# EAGLE design badgezadas (EAGLE 9.6.2)
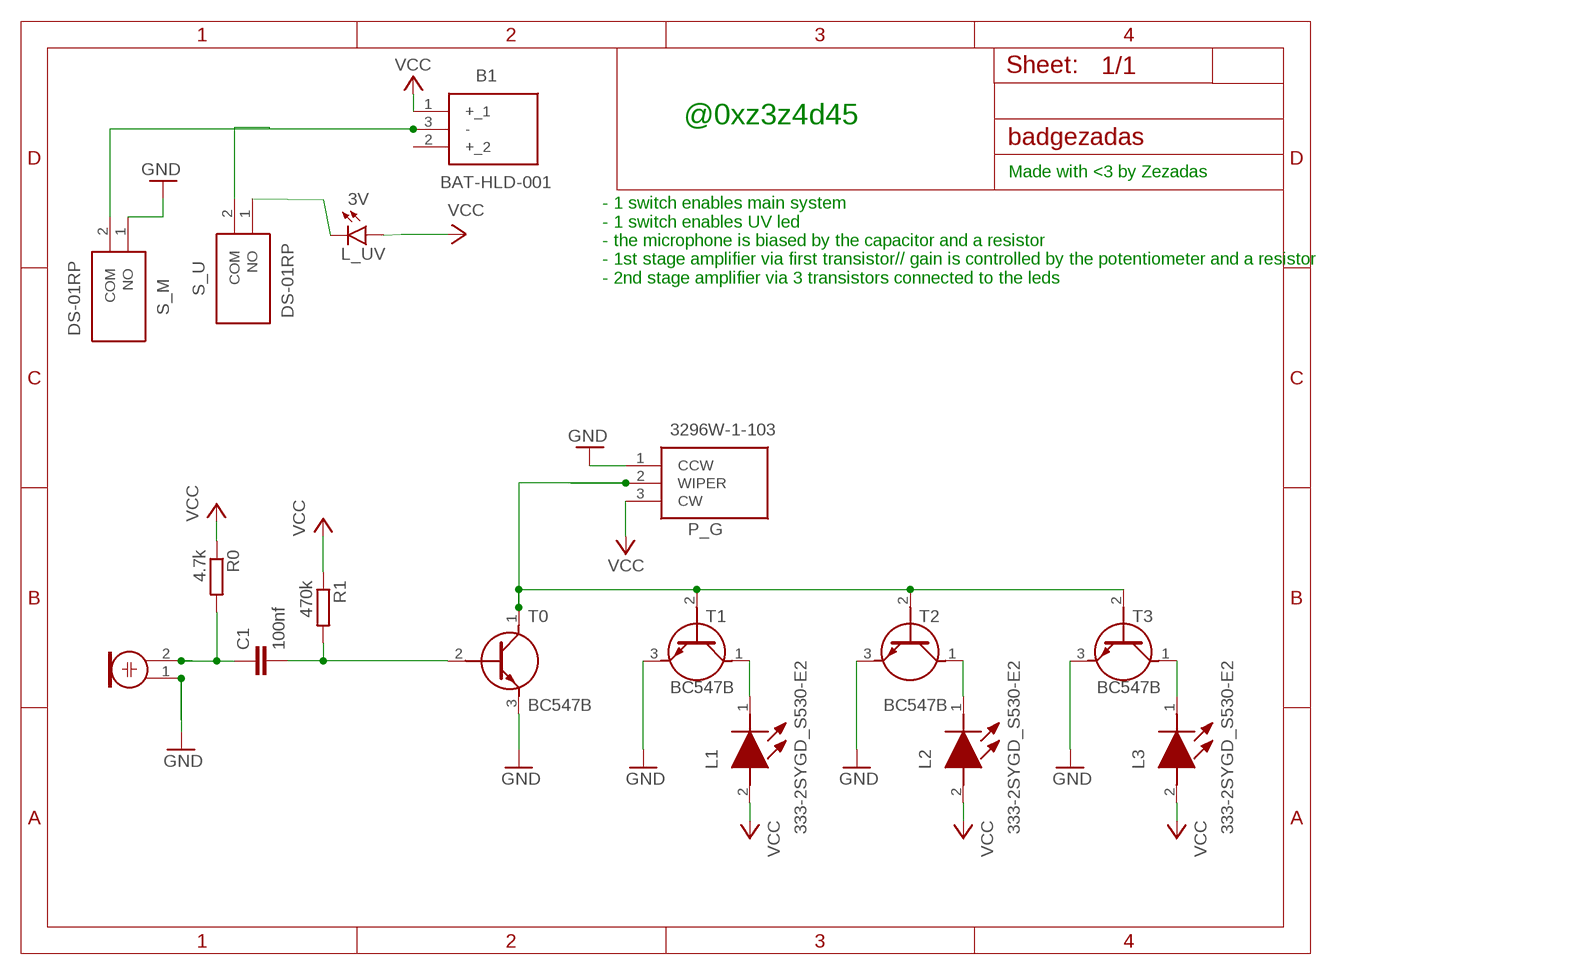
[diagram p0: schematic, sheet 1]

## Parts
B1  BAT-HLD-001  [BATHLD001]
C1  100nf  C-EU025-024X044  [C025-024X044]
L1  333-2SYGD_S530-E2  [3332SYGDS530E2]
L2  333-2SYGD_S530-E2  [3332SYGDS530E2]
L3  333-2SYGD_S530-E2  [3332SYGDS530E2]
L_UV  3V  LED3MM  [LED3MM]
M0  ELECTRET_MICROPHON-F6050AP  [F6050AP]
P_G  3296W-1-103  [3296W1103]
R0  4.7k  R-EU_0207/10  [0207/10]
R1  470k  R-EU_0207/10  [0207/10]
S_M  DS-01RP  [DS01RP]
S_U  DS-01RP  [DS01RP]
T0  BC547B  [TO-92-PLASTIC_2]
T1  BC547B  [TO-92-PLASTIC_2]
T2  BC547B  [TO-92-PLASTIC_2]
T3  BC547B  [TO-92-PLASTIC_2]

## Nets
GND: M0.1 P_G.1(CCW) S_M.1(NO) T0.3(E) T1.3(E) T2.3(E) T3.3(E)
N$1: C1.1 M0.2 R0.2
N$2: C1.2 R1.2 T0.2(B)
N$3: L_UV.K(C) S_U.1(NO)
N$4: P_G.2(WIPER) T0.1(C) T1.2(B) T2.2(B) T3.2(B)
N$5: L1.1(K) T1.1(C)
N$6: L3.1(K) T3.1(C)
N$7: B1.3(-) S_M.2(COM) S_U.2(COM)
N$10: L2.1(K) T2.1(C)
VCC: B1.1(+_1) L1.2(A) L2.2(A) L3.2(A) L_UV.A P_G.3(CW) R0.1 R1.1
Unconnected: B1.2(+_2)

## Notes on the sheet
- @0xz3z4d45
- Made with <3 by Zezadas
- - 1 switch enables main system
   - 1 switch enables UV led
   - the microphone is biased by the capacitor and a resistor
   - 1st stage amplifier via first transistor// gain is controlled by the potentiometer and a resistor
   - 2nd stage amplifier via 3 transistors connected to the leds

## Library data of the parts
B1 = BAT-HLD-001:BAT-HLD-001: Battery Holders, CR2032, 1 Position, Horizontal, Nickel, PCB Mount Alignment, Power, -40 257 F [-40 125 C] Source: Datasheet <https://www.te.com/commerce/DocumentDelivery/DDEController?Action=showdoc&DocId=Customer DrawingC-BAT-HLD-001-xxEpdfEnglishENG_CD_C-BAT-HLD-001-xx_E.pdfBAT-HLD-001>; DESCRIPTION: Battery Holders, CR2032, 1 Position, Horizontal, Nickel, PCB Mount Alignment, Power, -40 257 F [-40 125 C]; HEIGHT: 4.3mm; MANUFACTURER_NAME: TE Connectivity; MANUFACTURER_PART_NUMBER: BAT-HLD-001; MOUSER_PART_NUMBER: N/A; MOUSER_PRICE-STOCK: https://www.mouser.co.uk/ProductDetail/TE-Connectivity/BAT-HLD-001?qs=ulEaXIWI0c9ygiI7v7%2FU1A%3D%3D
C1 = rcl:C-EU: CAPACITOR, European symbol; SPICEPREFIX: C
L1-L3 = 333-2SYGD_S530-E2:333-2SYGD_S530-E2: Standard LEDs - Through Hole Yel/Grn Diffused 573nm 80mcd Source: Datasheet <http://www.mouser.com/datasheet/2/143/333-2SYGD-S530-E2-1165770.pdf>; ARROW_PART_NUMBER: 333-2SYGD/S530-E2; ARROW_PRICE-STOCK: https://www.arrow.com/en/products/333-2sygds530-e2/everlight-electronics?region=europe; DESCRIPTION: Standard LEDs - Through Hole Yel/Grn Diffused 573nm 80mcd; HEIGHT: 8.9mm; MANUFACTURER_NAME: Everlight; MANUFACTURER_PART_NUMBER: 333-2SYGD/S530-E2; MOUSER_PART_NUMBER: 638-333-2SYGDS5302; MOUSER_PRICE-STOCK: https://www.mouser.co.uk/ProductDetail/Everlight/333-2SYGD-S530-E2?qs=6olcXJbp99TfcSE%252BJxNOoA%3D%3D
L_UV = led:LED: LED OSRAM: - CHIPLED LG R971, LG N971, LY N971, LG Q971, LY Q971, LO R971, LY R971 LH N974, LH R974 LS Q976, LO Q976, LY Q976 LO Q996 - Hyper CHIPLED LW Q18S LB Q993, LB Q99A, LB R99A - SideLED LS A670, LO A670, LY A670, LG A670, LP A670 LB A673, LV A673, LT A673, LW A673 LH A674 LY A675 LS A676, LA A676, LO A676, LY A676, LW A676 LS A679, LY A679, LG A679 - Hyper Micro SIDELED® LS Y876, LA Y876, LO Y876, LY Y876 LT Y87S - SmartLED LW L88C, LW L88S LB L89C, LB L89S, LG L890 LS L89K, LO L89K, LY L89K LS L896, LA L896, LO L896, LY L896 - TOPLED LS T670, LO T670, LY T670, LG T670, LP T670 LSG T670, LSP T670, LSY T670, LOP T670, LYG T670 LG T671, LOG T671, LSG T671 LB T673, LV T673, LT T673, LW T673 LH T674 LS T676, LA T676, LO T676, LY T676, LB T676, LH T676, LSB T676, LW T676 LB T67C, LV T67C, LT T67C, LS T67K, LO T67K, LY T67K, LW E67C LS E67B, LA E67B, LO E67B, LY E67B, LB E67C, LV E67C, LT E67C LW T67C LS T679, LY T679, LG T679 LS T770, LO T770, LY T770, LG T770, LP T770 LB T773, LV T773, LT T773, LW T773 LH T774 LS E675, LA E675, LY E675, LS T675 LS T776, LA T776, LO T776, LY T776, LB T776 LHGB T686 LT T68C, LB T68C - Hyper Mini TOPLED® LB M676 - Mini TOPLED Santana® LG M470 LS M47K, LO M47K, LY M47K Source: http://www.osram.convergy.de LUXEON: - LUMILED® LXK2-PW12-R00, LXK2-PW12-S00, LXK2-PW14-U00, LXK2-PW14-V00 LXK2-PM12-R00, LXK2-PM12-S00, LXK2-PM14-U00 LXK2-PE12-Q00, LXK2-PE12-R00, LXK2-PE12-S00, LXK2-PE14-T00, LXK2-PE14-U00 LXK2-PB12-K00, LXK2-PB12-L00, LXK2-PB12-M00, LXK2-PB14-N00, LXK2-PB14-P00, LXK2-PB14-Q00 LXK2-PR12-L00, LXK2-PR12-M00, LXK2-PR14-Q00, LXK2-PR14-R00 LXK2-PD12-Q00, LXK2-PD12-R00, LXK2-PD12-S00 LXK2-PH12-R00, LXK2-PH12-S00 LXK2-PL12-P00, LXK2-PL12-Q00, LXK2-PL12-R00 Source: www.luxeon.com KINGBRIGHT: KA-3528ASYC Source: www.kingbright.com
M0 = microphon:ELECTRET_MICROPHON-: Electret Condenser Microphone
P_G = 3296W-1-103:3296W-1-103: Trimmer Resistors - Through Hole 3/8" 10Kohms Sealed Vertical Adjust Source: Datasheet <https://www.bourns.com/data/global/pdfs/3296.pdf>; DESCRIPTION: Trimmer Resistors - Through Hole 3/8" 10Kohms Sealed Vertical Adjust; HEIGHT: 11.8mm; MANUFACTURER_NAME: Bourns; MANUFACTURER_PART_NUMBER: 3296W-1-103; MOUSER_PART_NUMBER: 652-3296W-1-103; MOUSER_PRICE-STOCK: https://www.mouser.co.uk/ProductDetail/Bourns/3296W-1-103?qs=T%252BU9C%252B7w6dI0ejYuMqy4%2FQ%3D%3D
R0 R1 = rcl:R-EU_: RESISTOR, European symbol; SPICEPREFIX: R
S_M S_U = DS-01RP:DS-01RP: Multifunctional Switch 2 Pin Source: Datasheet <https://datasheet.lcsc.com/szlcsc/1911181432_Korean-Hroparts-Elec-DS-01RP_C129059.pdf>; DESCRIPTION: Multifunctional Switch 2 Pin; HEIGHT: 6.5mm; MANUFACTURER_NAME: Korean Hroparts Elec; MANUFACTURER_PART_NUMBER: DS-01RP
T0 T1-T3 = BC547B:BC547B: MULTICOMP - BC547B - TRANSISTOR, NPN, 45V,100MA, TO-92 Source: Datasheet <http://www.farnell.com/datasheets/1680285.pdf>; DESCRIPTION: MULTICOMP - BC547B - TRANSISTOR, NPN, 45V,100MA, TO-92; HEIGHT: mm; MANUFACTURER_NAME: Multicomp Pro; MANUFACTURER_PART_NUMBER: BC547B

## Board
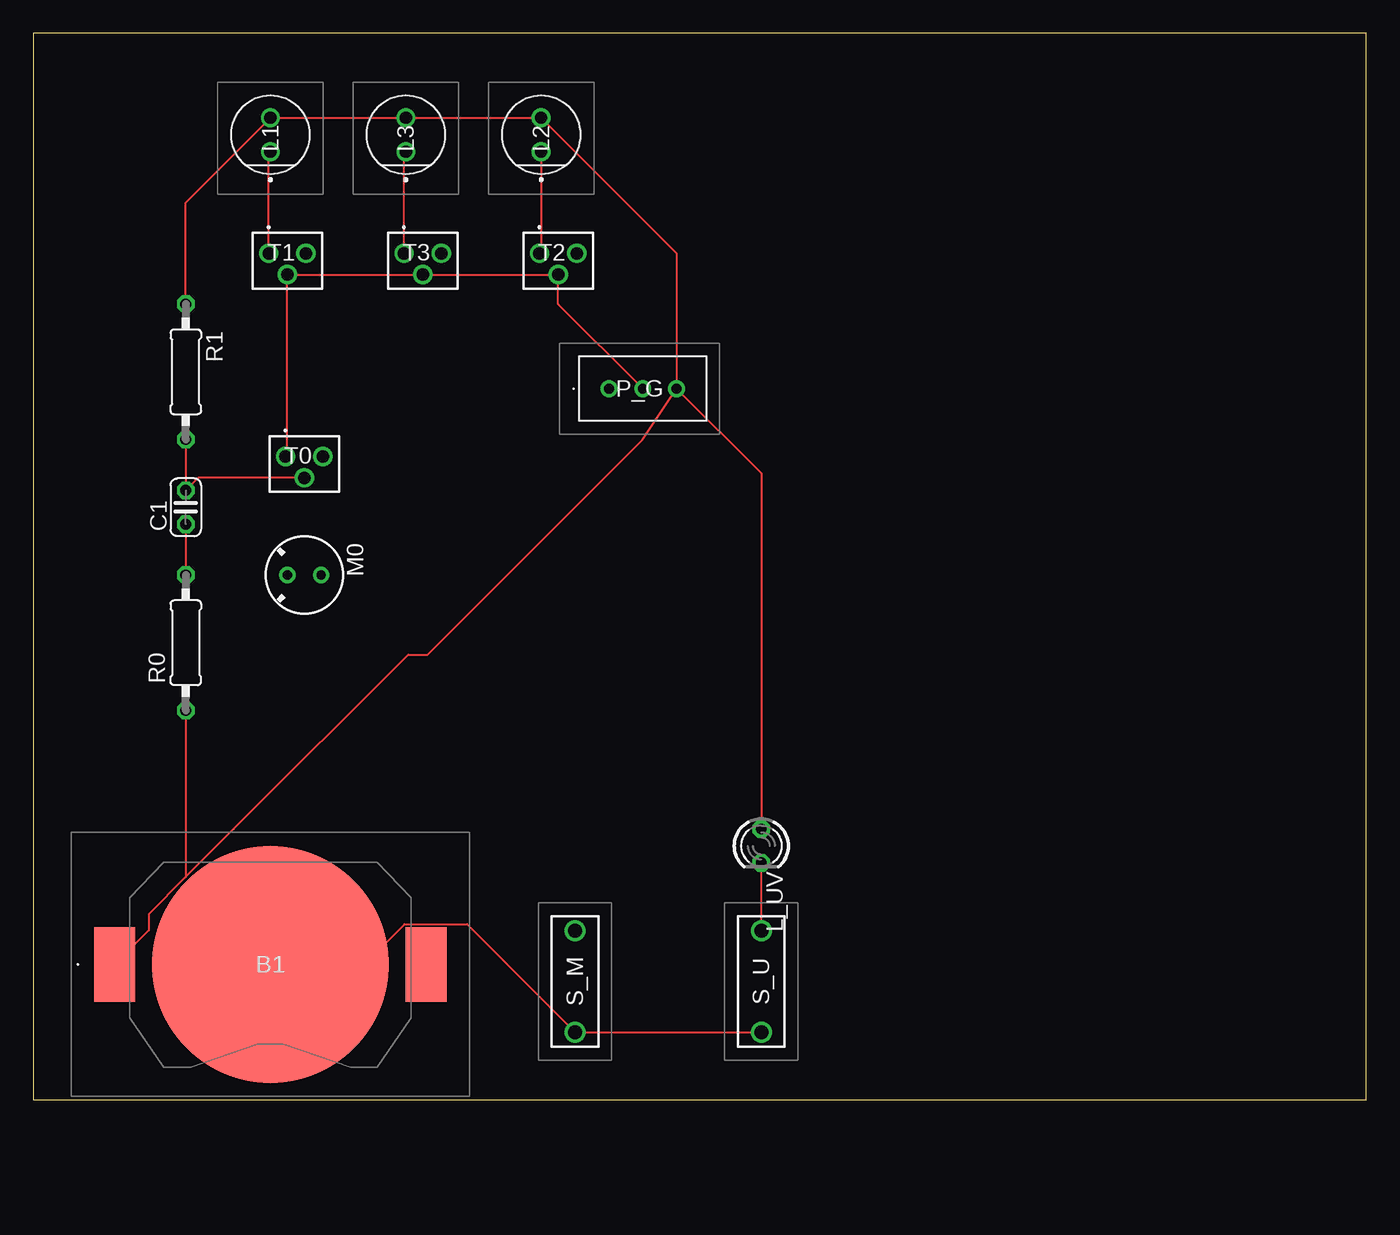
[diagram p1: board, top side]
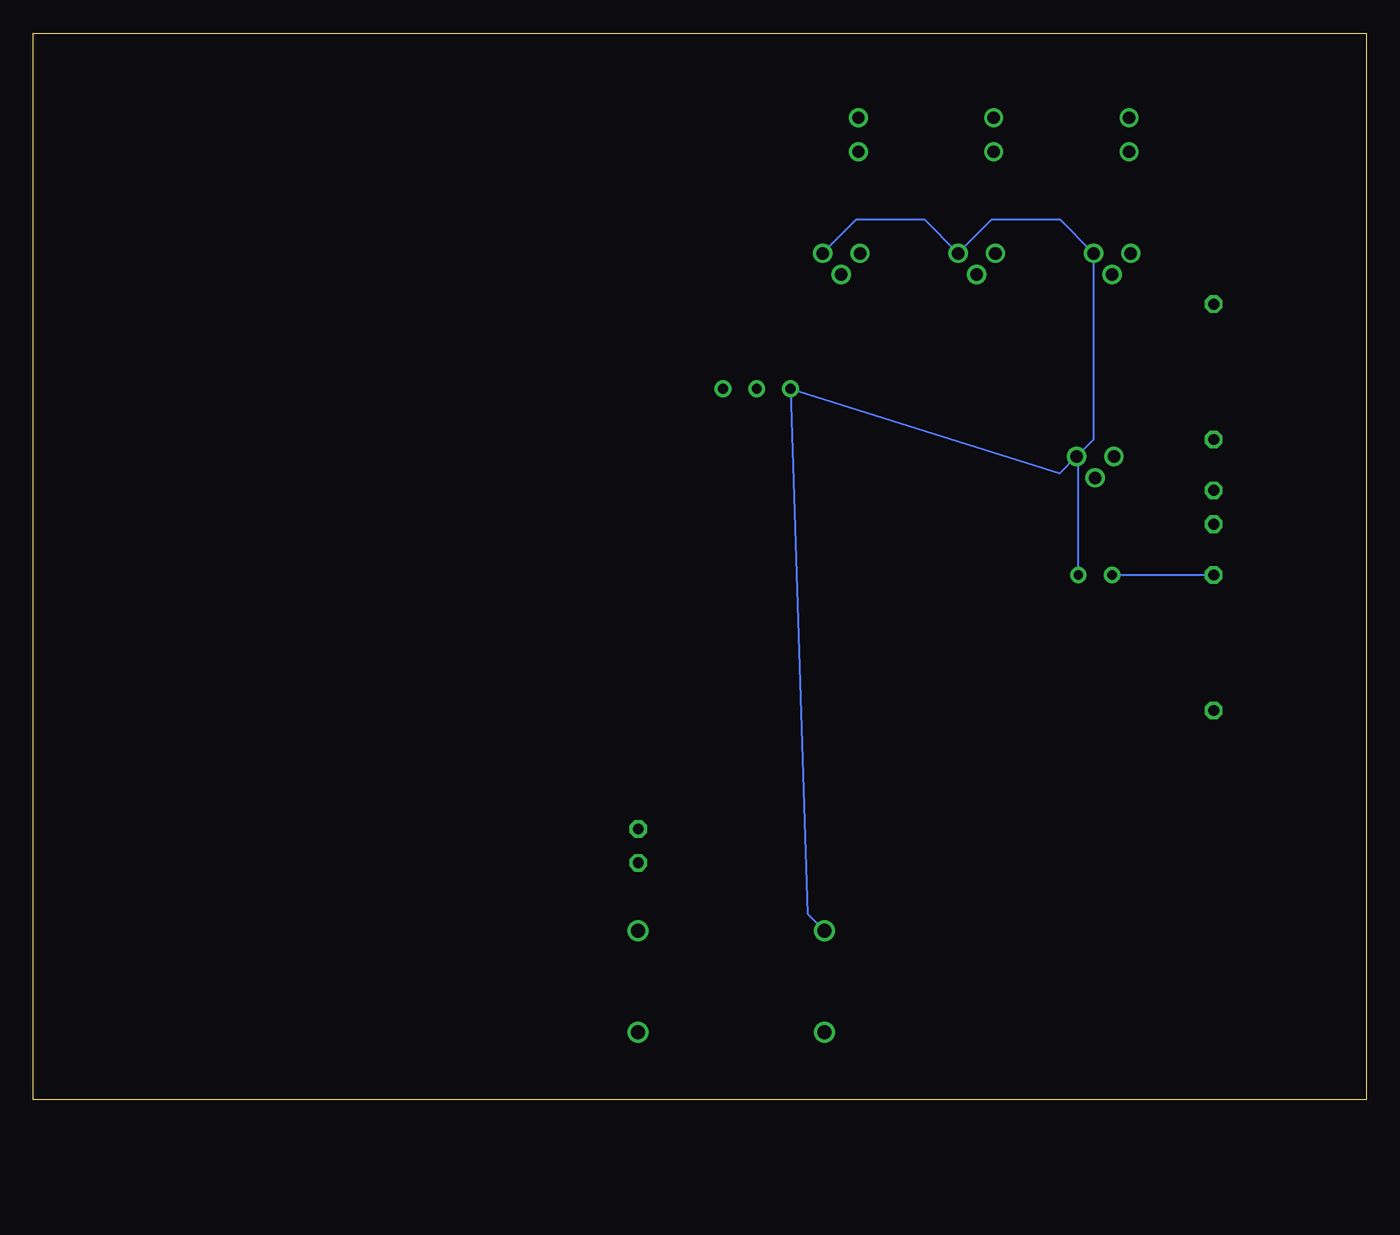
[diagram p2: board, bottom side, seen from below]

Size 100 x 80 mm. Coordinates in mm from the lower left corner, seen from the top.
Outline: 0,0 100,0 100,80 0,80 0,0
Copper layers (1*16): Top 0.035mm / dielectric 1.5mm / Bottom 0.035mm
Design rules "default": minimum track width 6mil, minimum drill 0.35mm, track to track 6mil, track to pad 6mil, pad to pad 6mil, via to via 6mil, smd to smd 6mil, copper to edge 40mil, drill to drill 6mil, minimum pad ring 10mil, minimum via ring 8mil, stop-mask expansion 4mil, vias tented up to drill 0mil, thermal gap 10mil

### Footprints (pad centres in the part's own frame; a part is rotated, then mirrored left to right if it is on the bottom)
BATHLD001 = smd 3.048 x 5.588: 1 -11.684,0; 2 11.684,0 | smd 17.8 x 17.8: 3 0,0
C025-024X044 = drill 0.813 octagon: 1 -1.27,0; 2 1.27,0
3332SYGDS530E2 = drill 0.91 pad 1.416: 1 0,0; 2 2.54,0
LED3MM = drill 0.813 octagon: A -1.27,0; K 1.27,0
F6050AP = drill 0.7 pad 1.2: 1 0,1.27; 2 0,-1.27
3296W1103 = drill 0.74 pad 1.269: 1 0,0; 2 2.54,0; 3 5.08,0
0207/10 = drill 0.813 octagon: 1 -5.08,0; 2 5.08,0
DS01RP = drill 1.05 pad 1.575: 1 0,0; 2 7.62,0
TO-92-PLASTIC_2 = drill 0.94 pad 1.44: 1 -1.4,0; 2 0,-1.6; 3 1.4,0

### Placement (x,y rotation side)
B1  17.78,10.16 0 top
C1  11.43,44.45 90 top
L1  17.78,71.12 90 top
L2  38.1,71.12 90 top
L3  27.94,71.12 90 top
L_UV  54.61,19.05 270 top
M0  20.32,39.37 270 top
P_G  43.18,53.34 0 top
R0  11.43,34.29 90 top
R1  11.43,54.61 270 top
S_M  40.64,12.7 270 top
S_U  54.61,12.7 270 top
T0  20.32,48.26 0 top
T1  19.05,63.5 0 top
T2  39.37,63.5 0 top
T3  29.21,63.5 0 top

### Tracks (layer width: path | path; a pad name or v marks a point on that pad's centre or on a via)
GND
  Bottom 0.152: S_M.1 41.91,13.97 P_G.1 22.99,46.99 T0.3 21.66,48.33 | T2.3 38.23,66.04 33.15,66.04 T3.3 28.07,66.04 22.99,66.04 T1.3 20.45,49.53 21.66,48.33 | M0.1 21.59,48.26 21.66,48.33
N$1
  Top 0.152: C1.1 R0.2
  Bottom 0.152: R0.2 M0.2
N$2
  Top 0.152: R1.2 C1.2 12.37,46.66 T0.2
N$3
  Top 0.152: S_U.1 L_UV.K
N$4
  Top 0.152: T0.1 19.05,48.39 T1.2 T3.2 T2.2 39.37,59.69 P_G.2
N$5
  Top 0.152: T1.1 17.65,70.99 L1.1
N$6
  Top 0.152: T3.1 27.81,70.99 L3.1
N$7
  Top 0.152: B1.3 24.82,10.16 27.84,13.18 32.54,13.18 S_M.2 S_U.2
N$10
  Top 0.152: L2.1 38.1,63.63 T2.1
VCC
  Top 0.152: B1.1 8.65,12.71 8.65,13.94 11.43,16.72 | P_G.3 45.71,49.53 29.58,33.4 28.11,33.4 15.03,20.32 11.43,16.72 | P_G.3 48.26,63.5 L2.2 L3.2 L1.2 11.43,67.31 R1.1 | R0.1 11.43,16.72 | P_G.3 54.61,46.99 L_UV.A